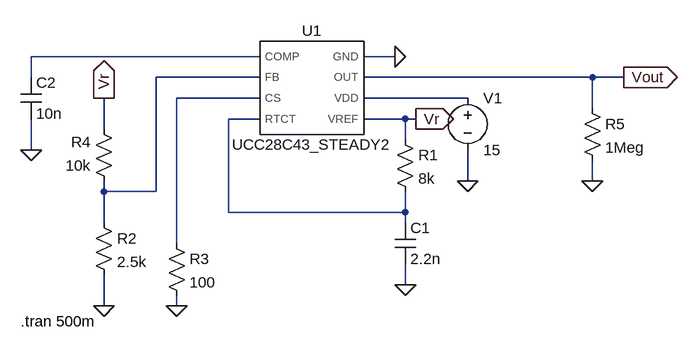
[diagram p0: schematic Test_IC.asc]
Test_IC.asc, the LTspice schematic file:
Version 4
SHEET 1 880 680
WIRE 112 144 -240 144
WIRE 320 144 272 144
WIRE -240 176 -240 144
WIRE 112 176 -48 176
WIRE 624 176 272 176
WIRE 672 176 624 176
WIRE 112 208 -16 208
WIRE 432 208 272 208
WIRE 624 224 624 176
WIRE 112 240 64 240
WIRE 336 240 272 240
WIRE 352 240 336 240
WIRE -128 256 -128 208
WIRE 336 272 336 240
WIRE -240 288 -240 240
WIRE 432 336 432 288
WIRE 624 336 624 304
WIRE -128 352 -128 336
WIRE -48 352 -48 176
WIRE -48 352 -128 352
WIRE 64 384 64 240
WIRE 336 384 336 352
WIRE 336 384 64 384
WIRE -128 400 -128 352
WIRE 336 400 336 384
WIRE -16 432 -16 208
WIRE 336 496 336 464
WIRE -128 528 -128 480
WIRE -16 528 -16 512
FLAG 432 336 0
FLAG 320 144 0
FLAG 336 496 0
FLAG -240 288 0
FLAG -16 528 0
FLAG -128 528 0
FLAG 624 336 0
FLAG 352 240 Vr
IOPIN 352 240 Out
FLAG -128 208 Vr
IOPIN -128 208 Out
FLAG 672 176 Vout
IOPIN 672 176 Out
SYMBOL UCC28C43_STEADY2 192 192 R0
SYMATTR InstName U1
SYMBOL voltage 432 192 R0
WINDOW 123 0 0 Left 0
WINDOW 39 0 0 Left 0
SYMATTR InstName V1
SYMATTR Value 15
SYMBOL res 320 256 R0
SYMATTR InstName R1
SYMATTR Value 8k
SYMBOL cap 320 400 R0
SYMATTR InstName C1
SYMATTR Value 2.2n
SYMBOL cap -256 176 R0
SYMATTR InstName C2
SYMATTR Value 10n
SYMBOL res -144 384 R0
SYMATTR InstName R2
SYMATTR Value 2.5k
SYMBOL res -32 416 R0
SYMATTR InstName R3
SYMATTR Value 100
SYMBOL res -112 352 R180
WINDOW 0 36 76 Left 2
WINDOW 3 36 40 Left 2
SYMATTR InstName R4
SYMATTR Value 10k
SYMBOL res 608 208 R0
SYMATTR InstName R5
SYMATTR Value 1Meg
TEXT -256 552 Left 2 !.tran 500m

The netlist it stands for:
* Test_IC.asc
XU1 N001 N002 N003 N005 0 Vout N004 Vr UCC28C43_STEADY2  ; pins COMP FB CS RTCT GND OUT VDD VREF
V1 N004 0 15
R1 Vr N005 8k
C1 N005 0 2.2n
C2 N001 0 10n
R2 N002 0 2.5k
R3 N003 0 100
R4 N002 Vr 10k
R5 Vout 0 1Meg
.tran 500m
.lib D:\GITHUB\GitHub\DCSource_DIY\Electronic-design\Stage-by-stage-design\00_DC-DC_Converter\LTSpice-simulation\UCC28C43_LTspice_Compatible_v2.lib
.backanno
.end